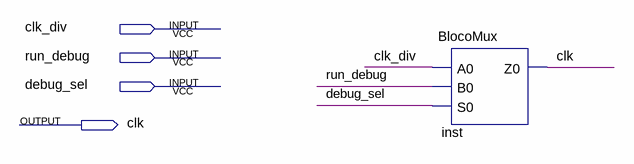
[diagram p0: schematic sheet]
// Quartus schematic RunStep.bdf as structural Verilog: 1 symbols, 4 pins
module RunStep (
  input  clk_div,
  input  run_debug,
  input  debug_sel,
  output clk
);

  BlocoMux inst (.A0(clk_div), .B0(run_debug), .S0(debug_sel), .Z0(clk));
endmodule
